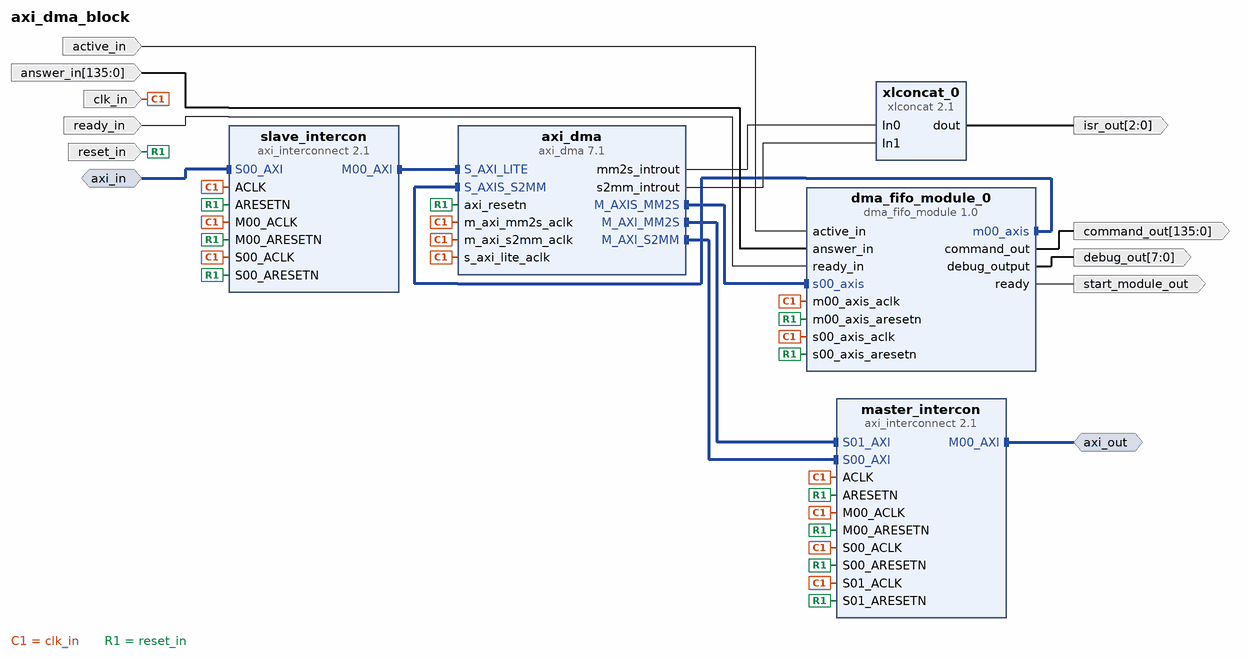
[diagram p0: block diagram of the top level]
# Vivado block design axi_dma_block, xc7z020clg400-1, Vivado 2022.1
create_bd_design axi_dma_block

create_bd_intf_port -mode Slave -vlnv xilinx.com:interface:aximm_rtl:1.0 axi_in
set_property -dict [list \
  CONFIG.ADDR_WIDTH 32 \
  CONFIG.ARUSER_WIDTH 0 \
  CONFIG.AWUSER_WIDTH 0 \
  CONFIG.BUSER_WIDTH 0 \
  CONFIG.DATA_WIDTH 32 \
  CONFIG.HAS_BRESP 1 \
  CONFIG.HAS_BURST 0 \
  CONFIG.HAS_CACHE 0 \
  CONFIG.HAS_LOCK 0 \
  CONFIG.HAS_PROT 0 \
  CONFIG.HAS_QOS 0 \
  CONFIG.HAS_REGION 0 \
  CONFIG.HAS_RRESP 1 \
  CONFIG.HAS_WSTRB 0 \
  CONFIG.ID_WIDTH 12 \
  CONFIG.MAX_BURST_LENGTH 16 \
  CONFIG.NUM_READ_OUTSTANDING 8 \
  CONFIG.NUM_READ_THREADS 4 \
  CONFIG.NUM_WRITE_OUTSTANDING 8 \
  CONFIG.NUM_WRITE_THREADS 4 \
  CONFIG.PROTOCOL AXI3 \
  CONFIG.READ_WRITE_MODE READ_WRITE \
  CONFIG.RUSER_BITS_PER_BYTE 0 \
  CONFIG.RUSER_WIDTH 0 \
  CONFIG.SUPPORTS_NARROW_BURST 0 \
  CONFIG.WUSER_BITS_PER_BYTE 0 \
  CONFIG.WUSER_WIDTH 0 \
] [get_bd_intf_ports axi_in]
create_bd_intf_port -mode Master -vlnv xilinx.com:interface:aximm_rtl:1.0 axi_out
set_property -dict [list \
  CONFIG.ADDR_WIDTH 32 \
  CONFIG.DATA_WIDTH 64 \
  CONFIG.NUM_READ_OUTSTANDING 8 \
  CONFIG.NUM_WRITE_OUTSTANDING 8 \
  CONFIG.PROTOCOL AXI3 \
] [get_bd_intf_ports axi_out]
create_bd_port -dir O -from 2 -to 0 isr_out
create_bd_port -dir O start_module_out
create_bd_port -dir O -from 7 -to 0 debug_out
create_bd_port -dir O -from 135 -to 0 command_out
create_bd_port -dir I -type rst reset_in
create_bd_port -dir I ready_in
create_bd_port -dir I active_in
create_bd_port -dir I -from 135 -to 0 answer_in
create_bd_port -dir I -type clk clk_in
set_property -dict {CONFIG.ASSOCIATED_BUSIF axi_out:axi_in CONFIG.FREQ_HZ 100000000} [get_bd_ports clk_in]

create_bd_cell -type ip -vlnv xilinx.com:ip:axi_dma:7.1 axi_dma
set_property -dict {CONFIG.c_include_s2mm 1 CONFIG.c_include_sg 0} [get_bd_cells axi_dma]
create_bd_cell -type ip -vlnv xilinx.com:ip:axi_interconnect:2.1 slave_intercon
set_property -dict {CONFIG.NUM_MI 1} [get_bd_cells slave_intercon]
create_bd_cell -type ip -vlnv xilinx.com:ip:axi_interconnect:2.1 master_intercon
set_property -dict {CONFIG.M00_HAS_REGSLICE 3 CONFIG.NUM_MI 1 CONFIG.NUM_SI 2} [get_bd_cells master_intercon]
create_bd_cell -type ip -vlnv xilinx.com:ip:xlconcat:2.1 xlconcat_0
create_bd_cell -type ip -vlnv seceng.fim.uni-passau.de:dma_fifo_module:dma_fifo_module:1.0 dma_fifo_module_0
set_property -dict {CONFIG.MASTER_START_COUNT 1} [get_bd_cells dma_fifo_module_0]

# ---- connections ----

connect_bd_intf_net -intf_net S00_AXI_0_1 [get_bd_intf_ports axi_in] [get_bd_intf_pins slave_intercon/S00_AXI]
connect_bd_intf_net [get_bd_intf_pins axi_dma/M_AXIS_MM2S] [get_bd_intf_pins dma_fifo_module_0/s00_axis]
connect_bd_intf_net [get_bd_intf_pins axi_dma/M_AXI_MM2S] [get_bd_intf_pins master_intercon/S01_AXI]
connect_bd_intf_net [get_bd_intf_pins axi_dma/M_AXI_S2MM] [get_bd_intf_pins master_intercon/S00_AXI]
connect_bd_intf_net [get_bd_intf_pins dma_fifo_module_0/m00_axis] [get_bd_intf_pins axi_dma/S_AXIS_S2MM]
connect_bd_intf_net [get_bd_intf_ports axi_out] [get_bd_intf_pins master_intercon/M00_AXI]
connect_bd_intf_net [get_bd_intf_pins slave_intercon/M00_AXI] [get_bd_intf_pins axi_dma/S_AXI_LITE]
connect_bd_net -net ACLK_0_1 [get_bd_ports clk_in] \
  [get_bd_pins slave_intercon/ACLK] [get_bd_pins slave_intercon/S00_ACLK] [get_bd_pins slave_intercon/M00_ACLK] \
  [get_bd_pins axi_dma/s_axi_lite_aclk] [get_bd_pins axi_dma/m_axi_mm2s_aclk] [get_bd_pins axi_dma/m_axi_s2mm_aclk] \
  [get_bd_pins master_intercon/S01_ACLK] [get_bd_pins master_intercon/M00_ACLK] [get_bd_pins master_intercon/S00_ACLK] \
  [get_bd_pins master_intercon/ACLK] [get_bd_pins dma_fifo_module_0/s00_axis_aclk] \
  [get_bd_pins dma_fifo_module_0/m00_axis_aclk]
connect_bd_net [get_bd_ports active_in] [get_bd_pins dma_fifo_module_0/active_in]
connect_bd_net [get_bd_ports answer_in] [get_bd_pins dma_fifo_module_0/answer_in]
connect_bd_net [get_bd_pins axi_dma/mm2s_introut] [get_bd_pins xlconcat_0/In0]
connect_bd_net [get_bd_pins axi_dma/s2mm_introut] [get_bd_pins xlconcat_0/In1]
connect_bd_net [get_bd_pins dma_fifo_module_0/command_out] [get_bd_ports command_out]
connect_bd_net [get_bd_pins dma_fifo_module_0/debug_output] [get_bd_ports debug_out]
connect_bd_net [get_bd_pins dma_fifo_module_0/ready] [get_bd_ports start_module_out]
connect_bd_net [get_bd_ports ready_in] [get_bd_pins dma_fifo_module_0/ready_in]
connect_bd_net -net rst_ps7_0_100M_peripheral_aresetn [get_bd_ports reset_in] \
  [get_bd_pins slave_intercon/S00_ARESETN] [get_bd_pins axi_dma/axi_resetn] [get_bd_pins slave_intercon/M00_ARESETN] \
  [get_bd_pins slave_intercon/ARESETN] [get_bd_pins master_intercon/M00_ARESETN] [get_bd_pins master_intercon/S00_ARESETN] \
  [get_bd_pins master_intercon/ARESETN] [get_bd_pins master_intercon/S01_ARESETN] \
  [get_bd_pins dma_fifo_module_0/s00_axis_aresetn] [get_bd_pins dma_fifo_module_0/m00_axis_aresetn]
connect_bd_net [get_bd_pins xlconcat_0/dout] [get_bd_ports isr_out]

# ---- address map ----
assign_bd_address -offset 0x00000000 -range 512M -target_address_space [get_bd_addr_spaces axi_dma/Data_MM2S] [get_bd_addr_segs axi_out/Reg]
assign_bd_address -offset 0x00000000 -range 512M -target_address_space [get_bd_addr_spaces axi_dma/Data_S2MM] [get_bd_addr_segs axi_out/Reg]
assign_bd_address -offset 0x40400000 -range 64K -target_address_space [get_bd_addr_spaces axi_in] [get_bd_addr_segs axi_dma/S_AXI_LITE/Reg]

validate_bd_design
save_bd_design
